# Altium schematic sheet Feedback.SchDoc
size 420 x 297 mm; DocumentNumber: 5; SheetNumber: 6; SheetTotal: 6; PageSetup: Record=PageOptions|CenterHorizontal=True|CenterVertical=True|PrintScale=0.96|XCorrection=1.00|YCorrection=1.00|PrintKind=1|BorderSize=5000000|LeftOffset=0|BottomOffset=0|Orientation=2|PaperLength=4318|PaperWidth=2794|Scale=100|PaperSource=7|PrintQuality=600|MediaType=1|DitherType=10|PaperKind=11" x 17"|PrintScaleMode=1
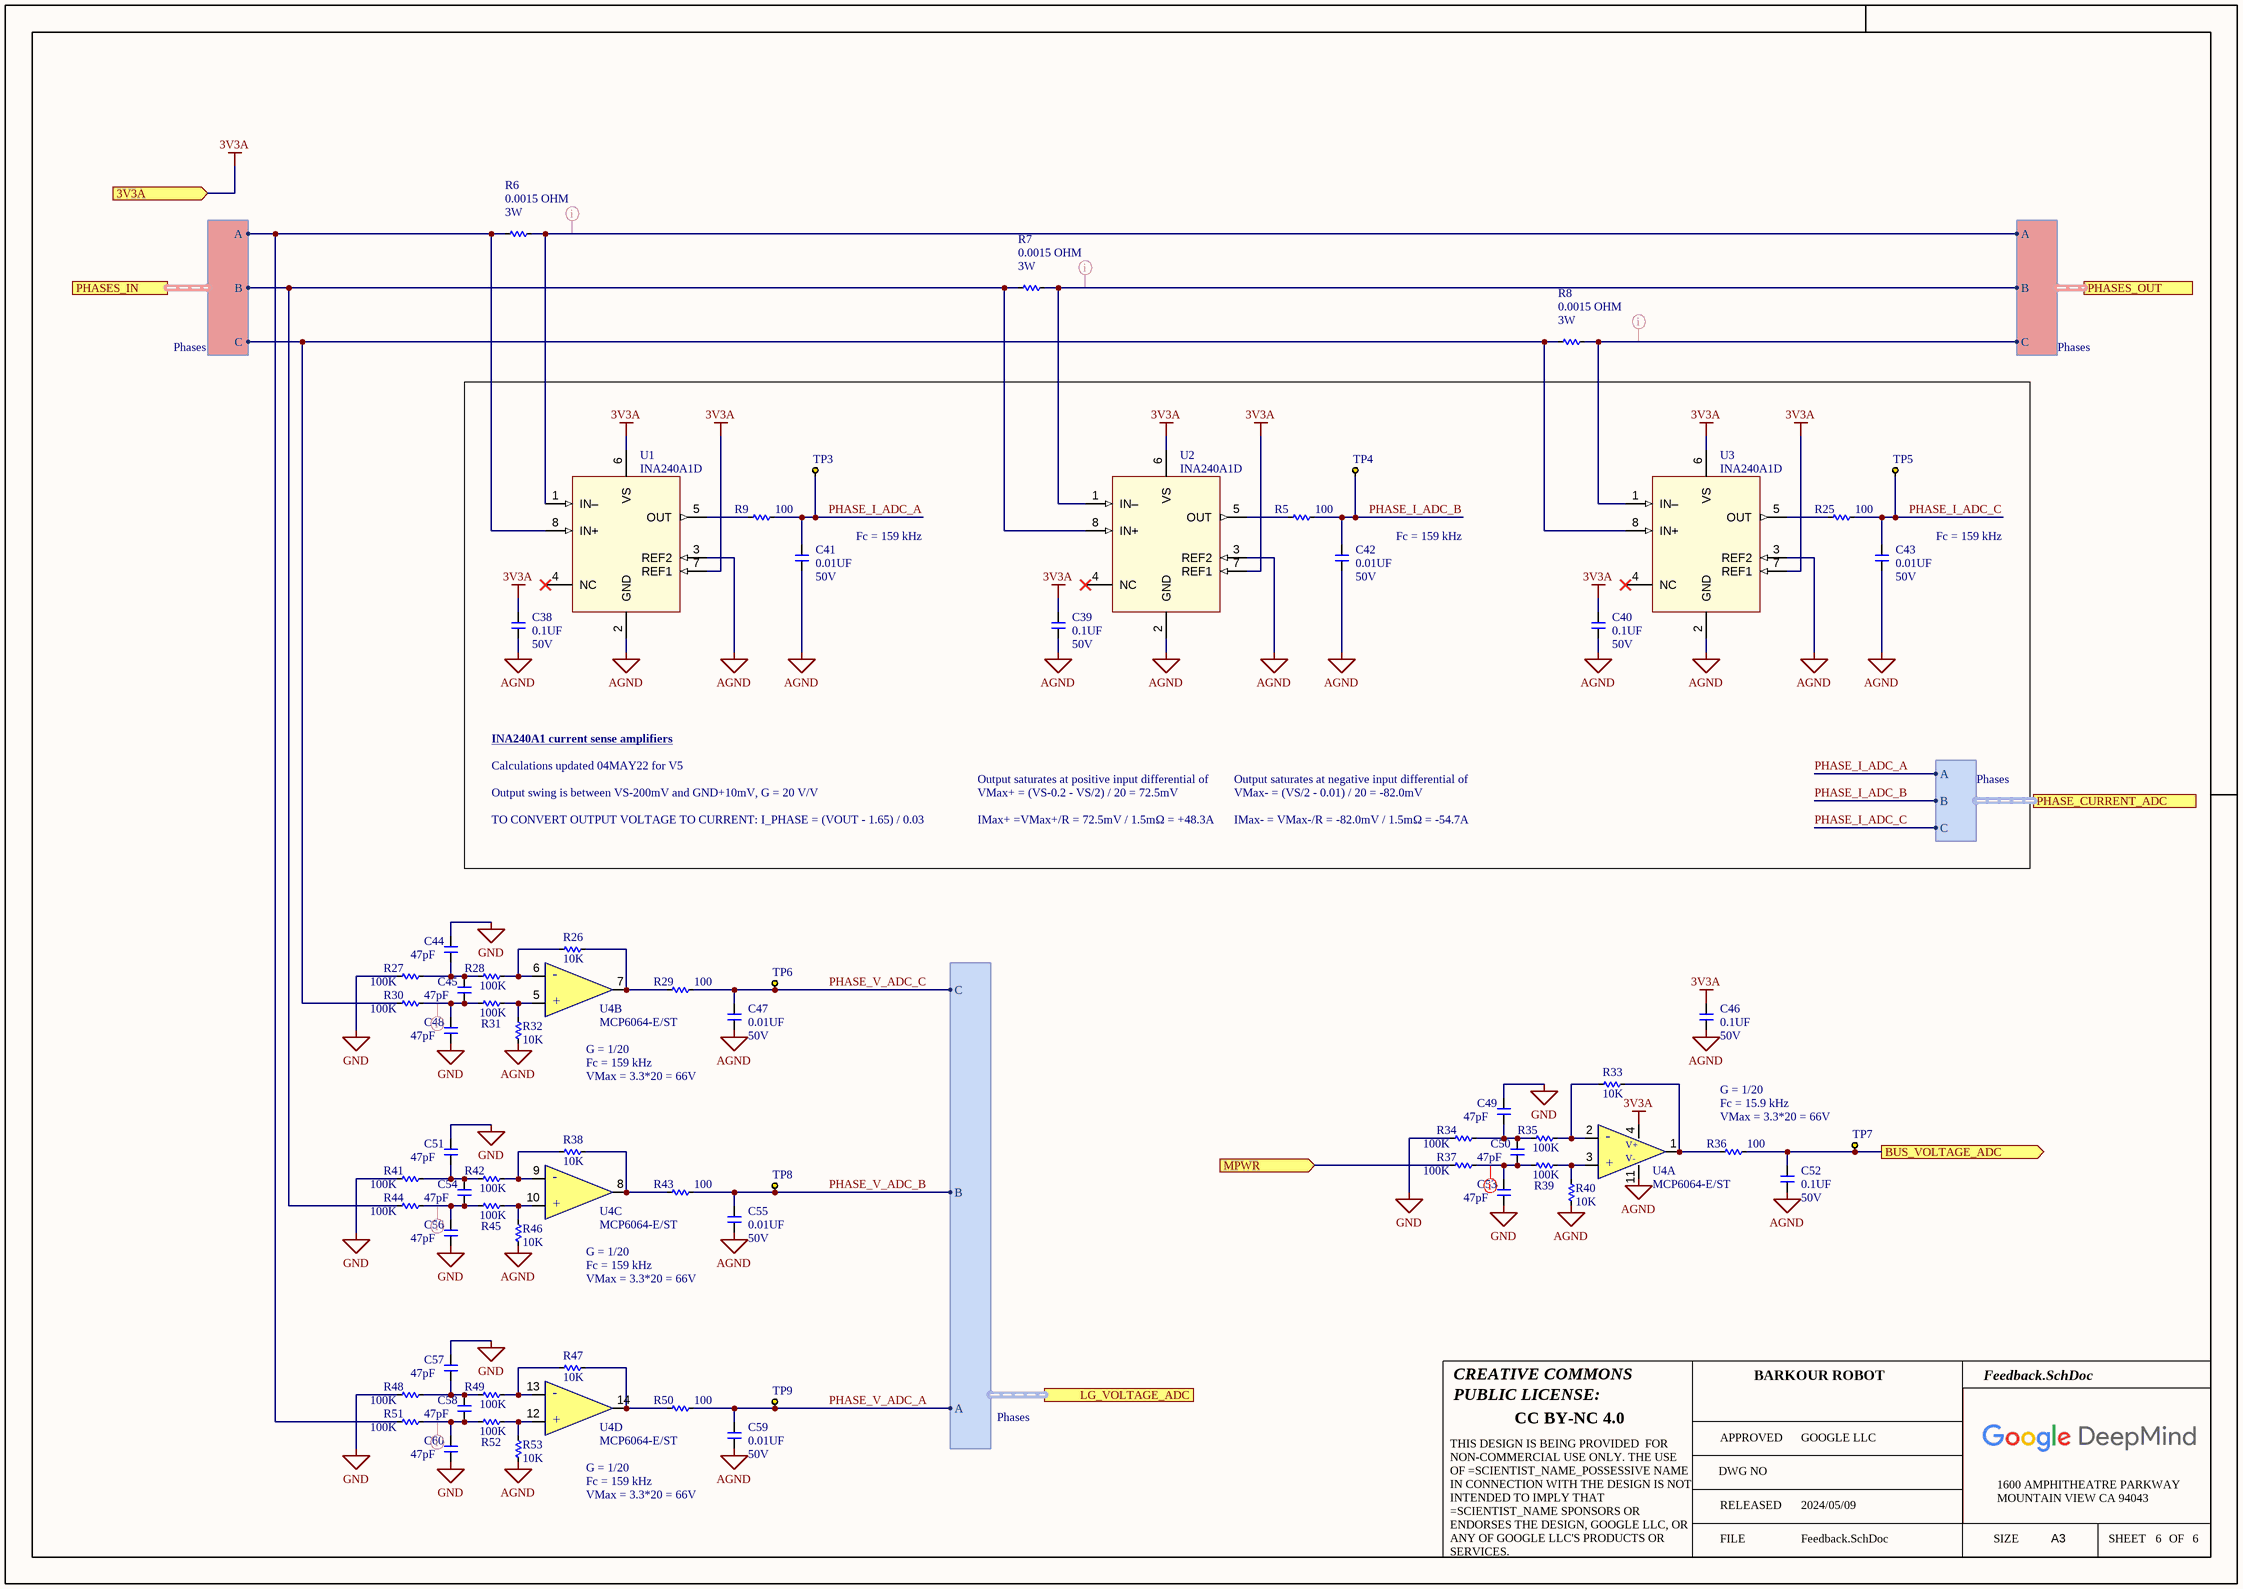
[diagram p0: Feedback.SchDoc]

## Parts
C38  value 0.1UF  Voltage: 50V  [C0402]  (hidden comment: __Template_Cap)
C39  value 0.1UF  Voltage: 50V  [C0402]  (hidden comment: __Template_Cap)
C40  value 0.1UF  Voltage: 50V  [C0402]  (hidden comment: __Template_Cap)
C41  value 0.01UF  Voltage: 50V  [C0402]  (hidden comment: __Template_Cap)
C42  value 0.01UF  Voltage: 50V  [C0402]  (hidden comment: __Template_Cap)
C43  value 0.01UF  Voltage: 50V  [C0402]  (hidden comment: __Template_Cap)
C44  value 47pF  [C0402]  (hidden comment: __Template_Cap)
C45  value 47pF  [C0402]  (hidden comment: __Template_Cap)
C46  value 0.1UF  Voltage: 50V  [C0402]  (hidden comment: __Template_Cap)
C47  value 0.01UF  Voltage: 50V  [C0402]  (hidden comment: __Template_Cap)
C48  value 47pF  [C0402]  (hidden comment: __Template_Cap)
C49  value 47pF  [C0402]  (hidden comment: __Template_Cap)
C50  value 47pF  [C0402]  (hidden comment: __Template_Cap)
C51  value 47pF  [C0402]  (hidden comment: __Template_Cap)
C52  value 0.1UF  Voltage: 50V  [C0402]  (hidden comment: __Template_Cap)
C53  value 47pF  [C0402]  (hidden comment: __Template_Cap)
C54  value 47pF  [C0402]  (hidden comment: __Template_Cap)
C55  value 0.01UF  Voltage: 50V  [C0402]  (hidden comment: __Template_Cap)
C56  value 47pF  [C0402]  (hidden comment: __Template_Cap)
C57  value 47pF  [C0402]  (hidden comment: __Template_Cap)
C58  value 47pF  [C0402]  (hidden comment: __Template_Cap)
C59  value 0.01UF  Voltage: 50V  [C0402]  (hidden comment: __Template_Cap)
C60  value 47pF  [C0402]  (hidden comment: __Template_Cap)
R5  value 100  [RES 0402_1005 RF]
R6  value 0.0015 OHM  Power: 3W  [R2512_H0.8MM]
R7  value 0.0015 OHM  Power: 3W  [R2512_H0.8MM]
R8  value 0.0015 OHM  Power: 3W  [R2512_H0.8MM]
R9  value 100  [R0402]
R25  value 100  [R0402]
R26  value 10K  [R0402]
R27  value 100K  [R0603]
R28  value 100K  [R0603]
R29  value 100  [R0402]
R30  value 100K  [R0603]
R31  value 100K  [R0603]
R32  value 10K  [R0402]
R33  value 10K  [R0402]
R34  value 100K  [R0603]
R35  value 100K  [R0603]
R36  value 100  [R0402]
R37  value 100K  [R0603]
R38  value 10K  [R0402]
R39  value 100K  [R0603]
R40  value 10K  [R0402]
R41  value 100K  [R0603]
R42  value 100K  [R0603]
R43  value 100  [R0402]
R44  value 100K  [R0603]
R45  value 100K  [R0603]
R46  value 10K  [R0402]
R47  value 10K  [R0402]
R48  value 100K  [R0603]
R49  value 100K  [R0603]
R50  value 100  [R0402]
R51  value 100K  [R0603]
R52  value 100K  [R0603]
R53  value 10K  [R0402]
TP3  TEST_KEYSTONE5015  [TP_KEYSTONE_5015]  (value not drawn)
TP4  TEST_KEYSTONE5015  [TP_KEYSTONE_5015]  (value not drawn)
TP5  TEST_KEYSTONE5015  [TP_KEYSTONE_5015]  (value not drawn)
TP6  TEST_KEYSTONE5015  [TP_KEYSTONE_5015]  (value not drawn)
TP7  TEST_KEYSTONE5015  [TP_KEYSTONE_5015]  (value not drawn)
TP8  TEST_KEYSTONE5015  [TP_KEYSTONE_5015]  (value not drawn)
TP9  TEST_KEYSTONE5015  [TP_KEYSTONE_5015]  (value not drawn)
U1  INA240A1D  [TI SOIC-8 D0008A]
U2  INA240A1D  [TI SOIC-8 D0008A]
U3  INA240A1D  [TI SOIC-8 D0008A]
U4  Manufacturer Part Number: MCP6064-E/ST  [14TSSOP65]  (hidden comment: MCP6064)  (parts A,B,C,D of 4)

## Ports
3V3A (in), BUS_VOLTAGE_ADC (out), LG_VOLTAGE_ADC (harness Phases), MPWR (in), PHASE_CURRENT_ADC (harness Phases), PHASES_IN (harness Phases), PHASES_OUT (harness Phases)

## Harnesses
Phases: A, B, C

## Nets
3V3A: C38.1 C39.1 C40.1 C46.1 U1.6(VS) U1.7(REF1) U2.6(VS) U2.7(REF1) U3.6(VS) U3.7(REF1) U4.4 ; port 3V3A
AGND: C38.2 C39.2 C40.2 C41.2 C42.2 C43.2 C46.2 C47.2 C52.2 C55.2 C59.2 R32.1 R40.1 R46.1 R53.1 U1.2(GND) U1.3(REF2) U2.2(GND) U2.3(REF2) U3.2(GND) U3.3(REF2) U4.11
GND: C44.2 C48.1 C49.2 C51.2 C53.1 C56.1 C57.2 C60.1 R27.1 R34.1 R41.1 R48.1
BUS_VOLTAGE_ADC: C52.1 R36.2 TP7.1 ; port BUS_VOLTAGE_ADC
MPWR: R37.1 ; port MPWR
PHASE_I_ADC_A: C41.1 R9.2 TP3.1 ; port PHASE_CURRENT_ADC.A
PHASE_I_ADC_B: C42.1 R5.2 TP4.1 ; port PHASE_CURRENT_ADC.B
PHASE_I_ADC_C: C43.1 R25.2 TP5.1 ; port PHASE_CURRENT_ADC.C
PHASE_V_ADC_A: C59.1 R50.2 TP9.1 ; port LG_VOLTAGE_ADC.A
PHASE_V_ADC_B: C55.1 R43.2 TP8.1 ; port LG_VOLTAGE_ADC.B
PHASE_V_ADC_C: C47.1 R29.2 TP6.1 ; port LG_VOLTAGE_ADC.C
NetC44_1: C44.1 C45.2 R27.2 R28.1
NetC45_1: C45.1 C48.2 R30.2 R31.1
NetC49_1: C49.1 C50.2 R34.2 R35.1
NetC50_1: C50.1 C53.2 R37.2 R39.1
NetC51_1: C51.1 C54.2 R41.2 R42.1
NetC54_1: C54.1 C56.2 R44.2 R45.1
NetC57_1: C57.1 C58.2 R48.2 R49.1
NetC58_1: C58.1 C60.2 R51.2 R52.1
NetR5_1: R5.1 U2.5(OUT)
NetR6_1: R6.1 R51.1 U1.8(IN+) ; port PHASES_IN.A
NetR6_2: R6.2 U1.1(IN–) ; port PHASES_OUT.A
NetR7_1: R7.1 R44.1 U2.8(IN+) ; port PHASES_IN.B
NetR7_2: R7.2 U2.1(IN–) ; port PHASES_OUT.B
NetR8_1: R8.1 R30.1 U3.8(IN+) ; port PHASES_IN.C
NetR8_2: R8.2 U3.1(IN–) ; port PHASES_OUT.C
NetR9_1: R9.1 U1.5(OUT)
NetR25_1: R25.1 U3.5(OUT)
NetR26_1: R26.1 R29.1 U4.7
NetR26_2: R26.2 R28.2 U4.6
NetR31_2: R31.2 R32.2 U4.5
NetR33_1: R33.1 R36.1 U4.1
NetR33_2: R33.2 R35.2 U4.2
NetR38_1: R38.1 R43.1 U4.8
NetR38_2: R38.2 R42.2 U4.9
NetR39_2: R39.2 R40.2 U4.3
NetR45_2: R45.2 R46.2 U4.10
NetR47_1: R47.1 R50.1 U4.14
NetR47_2: R47.2 R49.2 U4.13
NetR52_2: R52.2 R53.2 U4.12

Not connected (* = marked no-connect by the designer): U1 4(NC)*; U2 4(NC)*; U3 4(NC)*

## Layout directives
net class HVSW: NetC45_1, NetC54_1, NetC58_1, NetR6_2, NetR7_2, NetR8_2
net class HV: NetC50_1

## Notes on the sheet
- Fc = 159 kHz
- Output swing is between VS-200mV and GND+10mV, G = 20 V/V
- INA240A1 current sense amplifiers <https://www.ti.com/lit/ds/symlink/ina240.pdf>
- Calculations updated 04MAY22 for V5
- VMax+ = (VS-0.2 - VS/2) / 20 = 72.5mV
- Output saturates at positive input differential of
- VMax- = (VS/2 - 0.01) / 20 = -82.0mV
- Output saturates at negative input differential of
- TO CONVERT OUTPUT VOLTAGE TO CURRENT: I_PHASE = (VOUT - 1.65) / 0.03
- IMax+ =VMax+/R = 72.5mV / 1.5mΩ = +48.3A
- IMax- = VMax-/R = -82.0mV / 1.5mΩ = -54.7A
- (near U4) G = 1/20
- VMax = 3.3*20 = 66V
- Fc = 15.9 kHz
- G = 1/20
- CREATIVE COMMONS
- PUBLIC LICENSE:
- BARKOUR ROBOT
- CC BY-NC 4.0
- APPROVED
- DWG NO
- GOOGLE LLC
- FILE
- RELEASED
- 2024/05/09
- SIZE
- 1600 AMPHITHEATRE PARKWAY
- MOUNTAIN VIEW CA 94043
- A3
- SHEET
- OF
- THIS DESIGN IS BEING PROVIDED  FOR NON-COMMERCIAL USE ONLY. THE USE OF =SCIENTIST_NAME_POSSESSIVE NAME IN CONNECTION WITH THE DESIGN IS NOT INTENDED TO IMPLY THAT =SCIENTIST_NAME SPONSORS OR ENDORSES THE DESIGN, GOOGLE LLC, OR ANY OF GOOGLE LLC'S PRODUCTS OR SERVICES.
- (in symbol MICROCHIP_MCP6064, part A) -; V+; V-; +
- (in symbol MICROCHIP_MCP6064, part B) -; +
- (in symbol MICROCHIP_MCP6064, part C) -; +
- (in symbol MICROCHIP_MCP6064, part D) -; +

## Library data of the parts
C38-C40 C46 C52 = 1762: CAP, CER, X5R, 0.1uF, 10%, 50V, 0402, 0.55mm; ID: 1762; MFG: YAGEO; MFG P/N: CC0402KRX5R9BB104; EPIC: G150-02449-00; EES: 150-04581-00; Status: Released; Package: 0402; Dielectric: X5R; Tolerance: 10%; Height: 0.55mm; Supplier 1: Digi-Key; HelpURL: https://www.digikey.com/product-detail/en/yageo/CC0402KRX5R9BB104/311-3342-1-ND/6818312; ComponentLink1Description: Datasheet; ComponentLink1URL: http://www.yageo.com/documents/recent/UPY-GPHC_X5R_4V-to-50V_25.pdf; Supplier Part Number 1: 311-3342-1-ND
C41-C43 C47 C55 C59 = 625: CAP, CER, X7R, 0.01uF, 50V, 20%, 0402, 0.56mm T; ID: 625; MFG: KEMET; MFG P/N: C0402C103M5RACTU; XPN: 150-00227-00; EES: 150-04592-00; Status: Released; Package: 0402; Dielectric: X7R; Tolerance: 20%; Height: 0.56mm T; ComponentLink1Description: Datasheet; COMMON: 150-00227-00; LOON: 150-00227-00; Gecko: 150-00227-00
C44 C45 C48-C51 C53 C54 C56-C58 C60 = 1447: CAP, CER, C0G, 47PF, 5%, 50V, 0402; ID: 1447; MFG: TDK; MFG P/N: C1005C0G1H470J050BA; Dielectric: NP0; XPN: 150-00181-00; PROXY: 150-03463-00; Status: NRND; Package: 0402; Voltage: 50V; Tolerance: 5%; Height: 0.56mm T; ComponentLink1Description: Datasheet; COMMON: 150-00181-00
R5 R9 R25 R29 R36 R43 R50 = 7286: RES, 100, 1%, 1/10W, 0402, AUTO GRADE; ID: 7286; MFG: PANASONIC; MFG P/N: ERJ2RKF1000X; COMMON: 470-00294-00; PROXY: Use ID #8481; Status: Released; Package: 0402; Power: 1/10W; Tolerance: 1%; XPN: 470-00294-00
R6-R8 = 9999: RES, 0.0015, 1%, 3W, 2512; ID: 9999; MFG: TE Connectivity Passive Product; MFG P/N: TLR3A30DR0015FTDG; Catagory: Chip Resistor - Surface Mount; EES: 470-17948-00; Status: Released; Package: 2512; Tolerance: 1%; Height: 0.8mm; Supplier 1: Digi-Key; HelpURL: https://www.digikey.com/product-detail/en/te-connectivity-passive-product/TLR3A30DR0015FTDG/A131795CT-ND/8603925; ComponentLink1Description: Datasheet; ComponentLink1URL: https://www.te.com/commerce/DocumentDelivery/DDEController?Action=srchrtrv&DocNm=1773449-3&DocType=DS&DocLang=English; Supplier Part Number 1: A131795CT-ND
R26 R32 R33 R38 R40 R46 R47 R53 = 7216: RES, 10K, 1%, 1/10W, 0402, AUTOGRADE; ID: 7216; MFG: PANASONIC; MFG P/N: ERJ2RKF1002X; COMMON: 470-00319-00; Gecko: 470-17736-00; Status: Released; Package: 0402; Power: 1/10W; Tolerance: 1%; XPN: 470-00319-00
R27 R28 R30 R31 R34 R35 R37 R39 R41 R42 R44 R45 R48 R49 R51 R52 = 6516: RES, 100K, 1%, 1/10W, 0603, AUTO GRADE; ID: 6516; MFG: PANASONIC; MFG P/N: ERJ3EKF1003V; COMMON: 470-00120-00; PROXY: Use ID #8458; Status: Released; Package: 0603; Power: 1/10W; Tolerance: 1%; XPN: 470-00120-00
TP3-TP9 = TEST_KEYSTONE5015: PC TEST POINT MINIATURE SMT; Manufacturer: Keystone Electronics; Manufacturer Part Number: 5015; Part Number: 250-00207-00; Supplier 1: Digi-Key; RoHS: RoHS Compliant; Category: Test and Measurement; Stock 1: 1322985; Pricing 1: 1=0.44, 10=0.413, 50=0.301, 100=0.2891, 250=0.25964, 500=0.24784 (USD); Type: PC Test Point, Miniature; Terminal: 0.010" (0.25mm) Phosphor Bronze, Silver Plate; Mounting Type: Surface Mount; Material: Phosphor Bronze; Color: -; Packaging: Cut Tape (CT); ComponentLink1URL: http://mail.keyelco.com/ENG._DEPT/PDF%20CAT%20NO%20Drawings/5015.pdf; ComponentLink1Description: Datasheet; Supplier Part Number 1: 5015KCT-ND
U1-U3 = INA240A1: Current Sense Amplifiers -4 to 80V, bidirectional, ultra-precise current sense amplifier with enhanced PWM rejection, 20V/V gain; Manufacturer: Texas Instruments; Manufacturer Part Number: INA240A1D; Supplier 1: Digi-Key; Supplier 2: Mouser; Supplier 3: Farnell; Supplier Part Number 1: 296-51172-1-ND; Supplier Part Number 2: 595-INA240A1D; Supplier Part Number 3: 3005359
U4 = MICROCHIP_MCP6064: Microchip MCP6064-E/ST; Quad Op Amp; 0.73MHz CMOS; Rail to Rail; 3V; 5V; 14-Pin TSSOP; Min Supply Voltage: 1.8V; Max Supply Voltage: 6V; Voltage Gain: 115dB; Common Mode Rejection Ratio: 72dB; Gain Bandwidth Product: 730kHz; Number of Channels: 4; Output Current: 27mA; Slew Rate: 0.25V/µs; Nominal Supply Current: 60uA; Input Bias Current: 100pA; Input Offset Voltage (Vos): 150uV; Power Supply Rejection Ratio (PSRR): 70dB; Amplifier Type: GENERAL PURPOSE; ComponentLink1URL: http://www.microchip.com/mymicrochip/filehandler.aspx?ddocname=en528763; ComponentLink1Description: http://www.microchip.com/mymicrochip/filehandler.aspx?ddocname=en528763; Supplier 1: Digi-Key; Supplier Part Number 1: MCP6064-E/ST-ND; Manufacturer: Microchip; RoHS: Yes; Category: Amplifiers - Op Amps, Buffer, Instrumentation; Stock 1: 117; Pricing 1: 1=1.83000, 25=1.52640, 100=1.42500 (USD); Mount: Surface Mount; Case/Package: TSSOP; Number of Pins: 14; Min Operating Temperature: -40°C; Max Operating Temperature: 125°C; Package Quantity: 96; Packaging: Rail/Tube; Bandwidth: 730kHz; Unity Gain Bandwidth Product: 730kHz; Number of Circuits: 4; Operating Supply Current: 60uA; Output Current per Channel: 27mA; Number of Elements: 4; Number of Amplifiers: 4; Supply Current: 60uA; Technology: CMOS; Input Offset Voltage-Max: 150uV; Slew Rate-Nom: 0.25V/µs; Length: 5mm; Width: 4.4mm; Height: 1mm; Radiation Hardening: No; REACH SVHC: No SVHC; Lead Free: Lead Free; RoHS Compliant: Yes; ComponentLink2URL: https://datasheet.ciiva.com/8078/mcp6061-ds22189b-8078832.pdf?src-supplier=Element14; ComponentLink2Description: https://datasheet.ciiva.com/8078/mcp6061-ds22189b-8078832.pdf?src-supplier=Element14; ComponentLink3URL: https://datasheet.ciiva.com/1802/mcp6061-ds22189b-1802877.pdf?src-supplier=Digi-Key; ComponentLink3Description: https://datasheet.ciiva.com/1802/mcp6061-ds22189b-1802877.pdf?src-supplier=Digi-Key; ComponentLink4URL: https://datasheet.ciiva.com/11707/jp542225-11707116.pdf?src-supplier=Avnet; ComponentLink4Description: https://datasheet.ciiva.com/11707/jp542225-11707116.pdf?src-supplier=Avnet; ComponentLink5URL: https://datasheet.ciiva.com/5777/1062687-5777669.pdf?src-supplier=Farnell; ComponentLink5Description: https://datasheet.ciiva.com/5777/1062687-5777669.pdf?src-supplier=Farnell; ComponentLink6URL: https://datasheet.ciiva.com/16348/filehandler-aspxddocname-en542225-16348939.pdf?src-supplier=Future+Electronics; ComponentLink6Description: https://datasheet.ciiva.com/16348/filehandler-aspxddocname-en542225-16348939.pdf?src-supplier=Future+Electronics